# EAGLE design FULLBOARD_Rough_Draft (EAGLE 9.3.0)
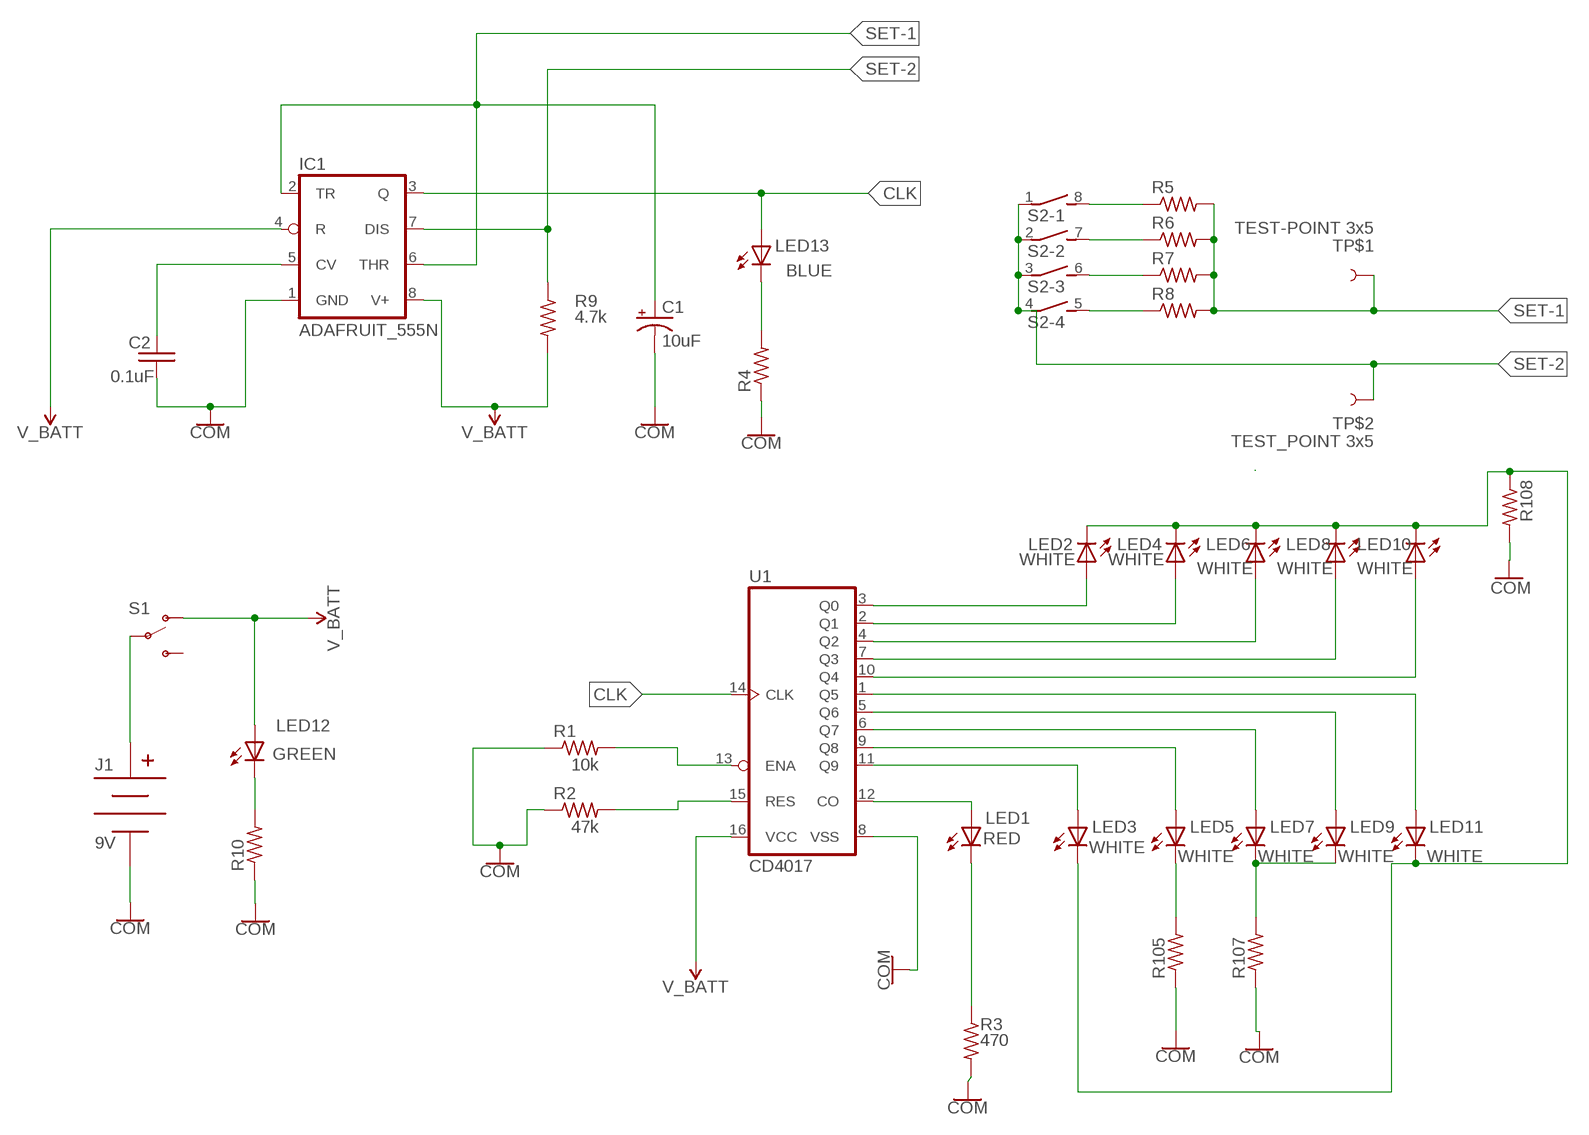
[diagram p0: schematic, sheet 1]

## Parts
C1  10uF  ADAFRUIT_CPOL-USE2-5  [ADAFRUIT_E2-5]
C2  0.1uF  ADAFRUIT_C-US025-025X050  [ADAFRUIT_C025-025X050]
IC1  ADAFRUIT_555N  [ADAFRUIT_DIL08-ROUND]
J1  9V  SPARKFUN-CONNECTORS_BC9VPC  [SPARKFUN-CONNECTORS_BC9VPC]
LED1  RED  ADAFRUIT_LED5MM  [ADAFRUIT_LED5MM]
LED2  WHITE  ADAFRUIT_LED5MM  [ADAFRUIT_LED5MM]
LED3  WHITE  ADAFRUIT_LED5MM  [ADAFRUIT_LED5MM]
LED4  WHITE  ADAFRUIT_LED5MM  [ADAFRUIT_LED5MM]
LED5  WHITE  ADAFRUIT_LED5MM  [ADAFRUIT_LED5MM]
LED6  WHITE  ADAFRUIT_LED5MM  [ADAFRUIT_LED5MM]
LED7  WHITE  ADAFRUIT_LED5MM  [ADAFRUIT_LED5MM]
LED8  WHITE  ADAFRUIT_LED5MM  [ADAFRUIT_LED5MM]
LED9  WHITE  ADAFRUIT_LED5MM  [ADAFRUIT_LED5MM]
LED10  WHITE  ADAFRUIT_LED5MM  [ADAFRUIT_LED5MM]
LED11  WHITE  ADAFRUIT_LED5MM  [ADAFRUIT_LED5MM]
LED12  ADAFRUIT_LED5MM  [ADAFRUIT_LED5MM]
LED13  ADAFRUIT_LED5MM  [ADAFRUIT_LED5MM]
R1  10k  ADAFRUIT_R-US_0207/10  [ADAFRUIT_0207/10]
R2  47k  ADAFRUIT_R-US_0207/10  [ADAFRUIT_0207/10]
R3  470  ADAFRUIT_R-US_0207/10  [ADAFRUIT_0207/10]
R4  ADAFRUIT_R-US_0207/10  [ADAFRUIT_0207/10]
R5  ADAFRUIT_R-US_0207/10  [ADAFRUIT_0207/10]
R6  ADAFRUIT_R-US_0207/10  [ADAFRUIT_0207/10]
R7  ADAFRUIT_R-US_0207/10  [ADAFRUIT_0207/10]
R8  ADAFRUIT_R-US_0207/10  [ADAFRUIT_0207/10]
R9  4.7k  ADAFRUIT_R-US_0207/10  [ADAFRUIT_0207/10]
R10  ADAFRUIT_R-US_0207/10  [ADAFRUIT_0207/10]
R105  ADAFRUIT_R-US_0207/10  [ADAFRUIT_0207/10]
R107  ADAFRUIT_R-US_0207/10  [ADAFRUIT_0207/10]
R108  ADAFRUIT_R-US_0207/10  [ADAFRUIT_0207/10]
S1  SPARKFUN-SWITCHES_SWITCH-SPDT-PTH-11.6X4.0MM  [SPARKFUN-SWITCHES_SWITCH_SPDT_PTH_11.6X4.0MM]
S2  SWITCH-DIL_DIP04S  [SWITCH-DIL_DIP04S]
TP$1  TEST-POINT 3x5  SPARKFUN-CONNECTORS_TEST-POINT3X5  [SPARKFUN-CONNECTORS_PAD.03X.05]
TP$2  TEST_POINT 3x5  SPARKFUN-CONNECTORS_TEST-POINT3X5  [SPARKFUN-CONNECTORS_PAD.03X.05]
U1  CD4017  SPARKFUN-IC-LOGIC_CD4017  [SPARKFUN-IC-LOGIC_DIP16]

## Nets
CLK: IC1.3(Q) LED13.A U1.14(CLK)
COLOR_COMMON: LED1.K(C) R3.1
GND: C1.- C2.2 IC1.1(GND) J1.V- R1.1 R2.1 R3.2 R4.1 R10.1 R105.1 R107.1 R108.2 U1.8(VSS) ; supply symbol labelled COM
N$1: R1.2 U1.13(ENA)
N$2: R2.2 U1.15(RES)
N$3: LED3.A U1.11(Q9)
N$4: LED5.A U1.9(Q8)
N$5: LED12.K(C) R10.2
N$6: LED7.A U1.6(Q7)
N$7: LED1.A U1.12(CO)
N$8: LED9.A U1.5(Q6)
N$9: LED11.A U1.1(Q5)
N$10: LED2.K(C) LED3.K(C) LED4.K(C) LED6.K(C) LED8.K(C) LED10.K(C) LED11.K(C) R108.1
N$11: LED2.A U1.3(Q0)
N$12: LED4.A U1.2(Q1)
N$13: LED6.A U1.4(Q2)
N$14: LED8.A U1.7(Q3)
N$15: LED10.A U1.10(Q4)
N$16: LED13.K(C) R4.2
N$17: LED5.K(C) R105.2
N$19: LED7.K(C) LED9.K(C) R107.2
N$22: J1.V+ S1.2(P)
N$24: R5.1 S2.8
N$25: R6.1 S2.7
N$26: R7.1 S2.6
N$27: R8.1 S2.5
N$29: C2.1 IC1.5(CV)
SET-1: C1.+ IC1.2(TR) IC1.6(THR) R5.2 R6.2 R7.2 R8.2 TP$1.P$1
SET-2: IC1.7(DIS) R9.1 S2.1 S2.2 S2.3 S2.4 TP$2.P$1
V_BATT: IC1.4(R) IC1.8(V+) LED12.A R9.2 S1.1(O) U1.16(VCC)
Unconnected: S1.3(S)

## Library data of the parts
C1 = SECTION B:ADAFRUIT_CPOL-US: POLARIZED CAPACITOR, American symbol
C2 = SECTION B:ADAFRUIT_C-US: CAPACITOR, American symbol
IC1 = SECTION B:ADAFRUIT_*555: TIMER Changed DIP package to have round (not oval) pin pads http://www.ladyada.net/library/pcb/eaglelibrary.html
J1 = SECTION A:SPARKFUN-CONNECTORS_BC9VPC: 9V Battery Holder - PC Mount Standard and Kit footprints included SparkFun Products: SparkFun SparkPunk Sound Kit <https://www.sparkfun.com/products/11177> SparkFun SparkPunk Sequencer Kit <https://www.sparkfun.com/products/12707>; PROD_ID: BATT-10855
LED1-LED11 = SECTION C:ADAFRUIT_LED: LED OSRAM: - CHIPLED LG R971, LG N971, LY N971, LG Q971, LY Q971, LO R971, LY R971 LH N974, LH R974 LS Q976, LO Q976, LY Q976 LO Q996 - Hyper CHIPLED LW Q18S LB Q993, LB Q99A, LB R99A - SideLED LS A670, LO A670, LY A670, LG A670, LP A670 LB A673, LV A673, LT A673, LW A673 LH A674 LY A675 LS A676, LA A676, LO A676, LY A676, LW A676 LS A679, LY A679, LG A679 - Hyper Micro SIDELED® LS Y876, LA Y876, LO Y876, LY Y876 LT Y87S - SmartLED LW L88C, LW L88S LB L89C, LB L89S, LG L890 LS L89K, LO L89K, LY L89K LS L896, LA L896, LO L896, LY L896 - TOPLED LS T670, LO T670, LY T670, LG T670, LP T670 LSG T670, LSP T670, LSY T670, LOP T670, LYG T670 LG T671, LOG T671, LSG T671 LB T673, LV T673, LT T673, LW T673 LH T674 LS T676, LA T676, LO T676, LY T676, LB T676, LH T676, LSB T676, LW T676 LB T67C, LV T67C, LT T67C, LS T67K, LO T67K, LY T67K, LW E67C LS E67B, LA E67B, LO E67B, LY E67B, LB E67C, LV E67C, LT E67C LW T67C LS T679, LY T679, LG T679 LS T770, LO T770, LY T770, LG T770, LP T770 LB T773, LV T773, LT T773, LW T773 LH T774 LS E675, LA E675, LY E675, LS T675 LS T776, LA T776, LO T776, LY T776, LB T776 LHGB T686 LT T68C, LB T68C - Hyper Mini TOPLED® LB M676 - Mini TOPLED Santana® LG M470 LS M47K, LO M47K, LY M47K Source: http://www.osram.convergy.de/
LED12 = SECTION A:ADAFRUIT_LED: LED OSRAM: - CHIPLED LG R971, LG N971, LY N971, LG Q971, LY Q971, LO R971, LY R971 LH N974, LH R974 LS Q976, LO Q976, LY Q976 LO Q996 - Hyper CHIPLED LW Q18S LB Q993, LB Q99A, LB R99A - SideLED LS A670, LO A670, LY A670, LG A670, LP A670 LB A673, LV A673, LT A673, LW A673 LH A674 LY A675 LS A676, LA A676, LO A676, LY A676, LW A676 LS A679, LY A679, LG A679 - Hyper Micro SIDELED® LS Y876, LA Y876, LO Y876, LY Y876 LT Y87S - SmartLED LW L88C, LW L88S LB L89C, LB L89S, LG L890 LS L89K, LO L89K, LY L89K LS L896, LA L896, LO L896, LY L896 - TOPLED LS T670, LO T670, LY T670, LG T670, LP T670 LSG T670, LSP T670, LSY T670, LOP T670, LYG T670 LG T671, LOG T671, LSG T671 LB T673, LV T673, LT T673, LW T673 LH T674 LS T676, LA T676, LO T676, LY T676, LB T676, LH T676, LSB T676, LW T676 LB T67C, LV T67C, LT T67C, LS T67K, LO T67K, LY T67K, LW E67C LS E67B, LA E67B, LO E67B, LY E67B, LB E67C, LV E67C, LT E67C LW T67C LS T679, LY T679, LG T679 LS T770, LO T770, LY T770, LG T770, LP T770 LB T773, LV T773, LT T773, LW T773 LH T774 LS E675, LA E675, LY E675, LS T675 LS T776, LA T776, LO T776, LY T776, LB T776 LHGB T686 LT T68C, LB T68C - Hyper Mini TOPLED® LB M676 - Mini TOPLED Santana® LG M470 LS M47K, LO M47K, LY M47K Source: http://www.osram.convergy.de/; COLOR: GREEN
LED13 = SECTION B:ADAFRUIT_LED: LED OSRAM: - CHIPLED LG R971, LG N971, LY N971, LG Q971, LY Q971, LO R971, LY R971 LH N974, LH R974 LS Q976, LO Q976, LY Q976 LO Q996 - Hyper CHIPLED LW Q18S LB Q993, LB Q99A, LB R99A - SideLED LS A670, LO A670, LY A670, LG A670, LP A670 LB A673, LV A673, LT A673, LW A673 LH A674 LY A675 LS A676, LA A676, LO A676, LY A676, LW A676 LS A679, LY A679, LG A679 - Hyper Micro SIDELED® LS Y876, LA Y876, LO Y876, LY Y876 LT Y87S - SmartLED LW L88C, LW L88S LB L89C, LB L89S, LG L890 LS L89K, LO L89K, LY L89K LS L896, LA L896, LO L896, LY L896 - TOPLED LS T670, LO T670, LY T670, LG T670, LP T670 LSG T670, LSP T670, LSY T670, LOP T670, LYG T670 LG T671, LOG T671, LSG T671 LB T673, LV T673, LT T673, LW T673 LH T674 LS T676, LA T676, LO T676, LY T676, LB T676, LH T676, LSB T676, LW T676 LB T67C, LV T67C, LT T67C, LS T67K, LO T67K, LY T67K, LW E67C LS E67B, LA E67B, LO E67B, LY E67B, LB E67C, LV E67C, LT E67C LW T67C LS T679, LY T679, LG T679 LS T770, LO T770, LY T770, LG T770, LP T770 LB T773, LV T773, LT T773, LW T773 LH T774 LS E675, LA E675, LY E675, LS T675 LS T776, LA T776, LO T776, LY T776, LB T776 LHGB T686 LT T68C, LB T68C - Hyper Mini TOPLED® LB M676 - Mini TOPLED Santana® LG M470 LS M47K, LO M47K, LY M47K Source: http://www.osram.convergy.de/; COLOR: BLUE
R1-R4 R10 R105 R107 R108 = SECTION C:ADAFRUIT_R-US_: RESISTOR, American symbol
R5-R8 = SECTION A:ADAFRUIT_R-US_: RESISTOR, American symbol
R9 = SECTION B:ADAFRUIT_R-US_: RESISTOR, American symbol
S1 = SECTION A:SPARKFUN-SWITCHES_SWITCH-SPDT: Single Pole, Double Throw (SPDT) Switch Single-pole, double-throw (SPDT) switch. Variant Overview SMD-AYZ0202 Surface Mount DPDT Switch <https://www.sparkfun.com/products/597> (COM-00597) Used on e.g. LilyPad Arduino USB - ATmega32U4 Board <https://www.sparkfun.com/products/12049> PTH-11.6X4.0MM SPDT Mini Power Switch <https://www.sparkfun.com/products/102> (COM-00102) Used on e.g. SparkFun Simon Says - Through-Hole Soldering Kit <https://www.sparkfun.com/products/10547> (KIT-10547) PTH-11.6X4.0MM-KIT KIT version of SPDT Mini Power Switch - Simplifies soldering by removing tStop of switch pins - only one side can be soldered. PTH-11.6X4.0MM-LOCK LOCK version of SPDT Mini Power Switch - Offset pins hold switch in place for easier soldering. SMD-RIGHT-ANGLE Surface Mount Right Angle Switch <https://www.sparkfun.com/products/10860> (COM-10860) Used on e.g. SparkFun ESP8266 Thing <https://www.sparkfun.com/products/13231>; PROD_ID: SWCH-10651; SF_ID: COM-00597; SF_SKU: COM-10860
S2 = SECTION A:SWITCH-DIL_DIP04S: DIL/CODE SWITCH; OC_FARNELL: unknown; OC_NEWARK: unknown
TP$1 TP$2 = SECTION A:SPARKFUN-CONNECTORS_TEST-POINT: SparkFun Test Points Bare copper test points for troubleshooting or In-Circuit-Testing. These are used by our Production team for verifying production board runs using pogo-pins on test beds. SparkFun Products: SparkFun LSM9DS1 Breakout <https://www.sparkfun.com/products/13284> SparkFun PSOC <https://www.sparkfun.com/products/13714> SparkFun Load Cell Amplifier <https://www.sparkfun.com/products/13879>
U1 = SECTION C:SPARKFUN-IC-LOGIC_CD4017: 10-Out Decade Counter Datasheet <https://cdn.sparkfun.com/datasheets/Kits/cd4022b.pdf> SparkFun Products SparkFun SparkPunk Sequencer Kit <https://www.sparkfun.com/products/12707> (KIT-12707); PROD_ID: IC-11929

## Board
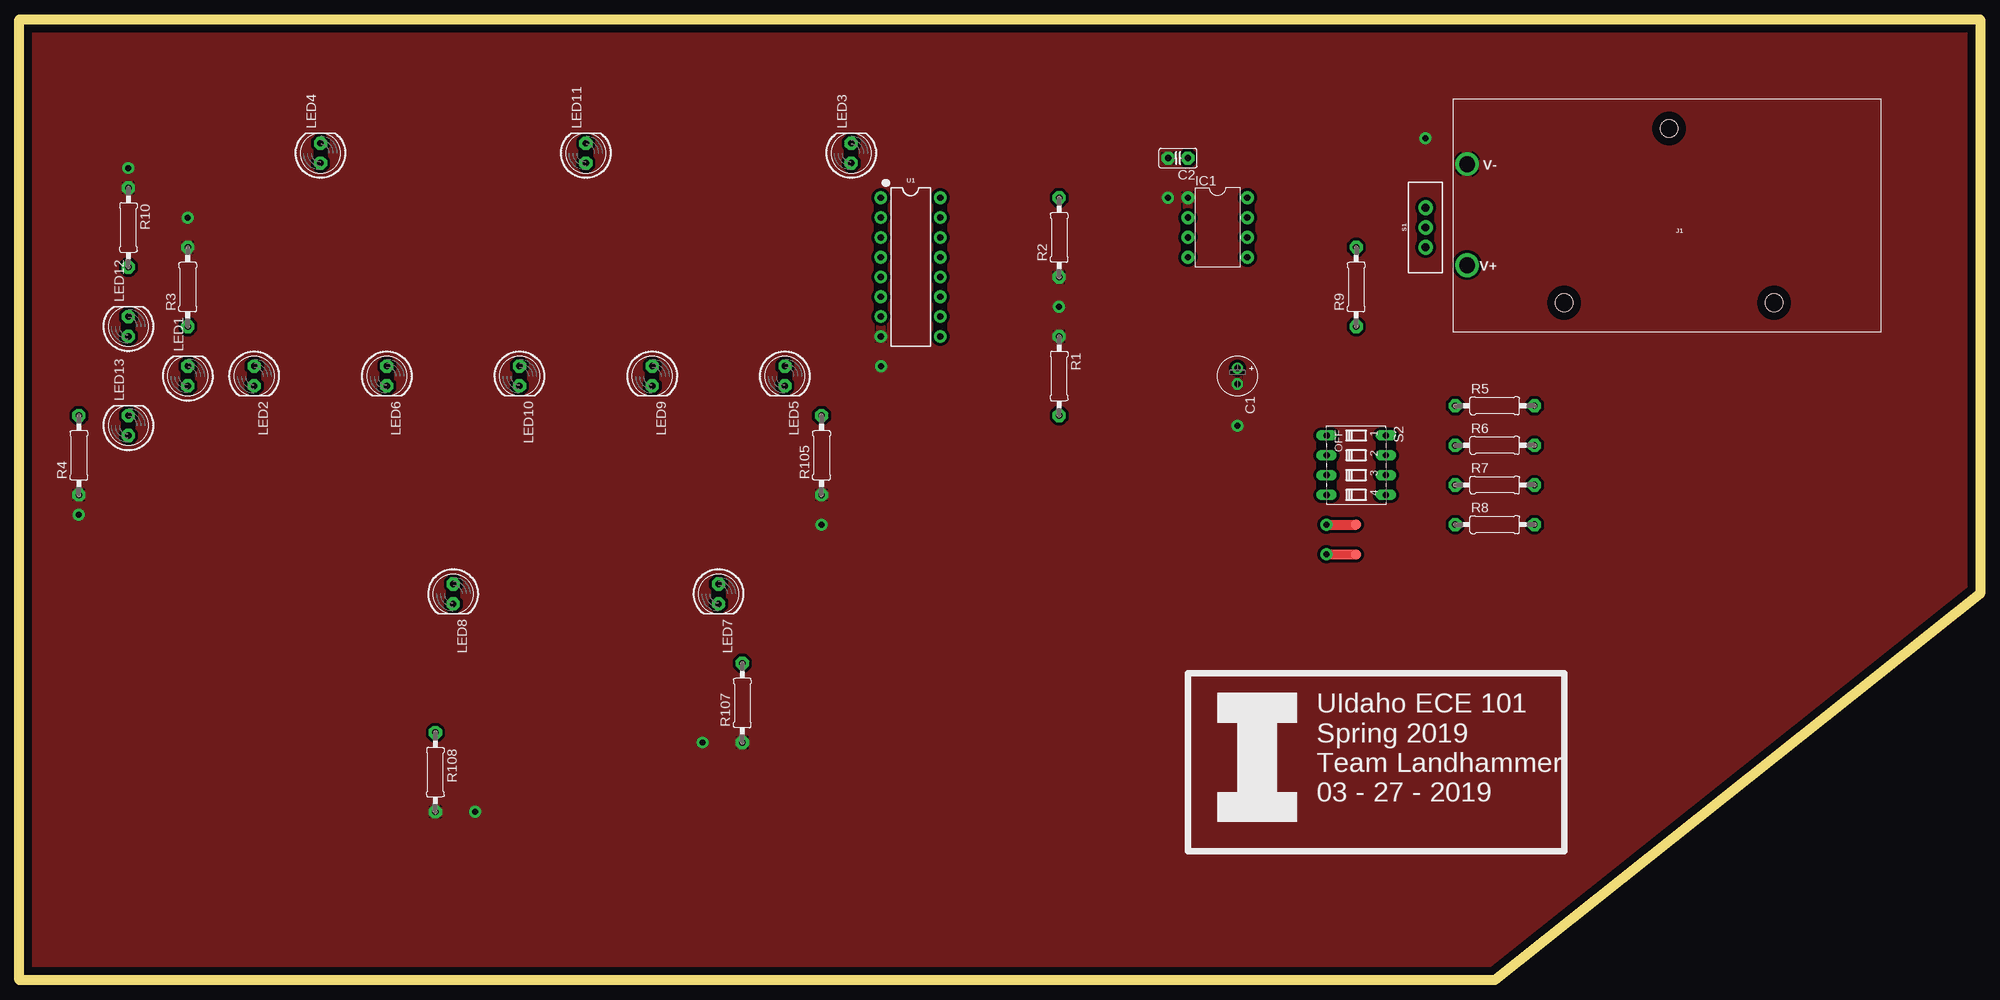
[diagram p1: board, top side]
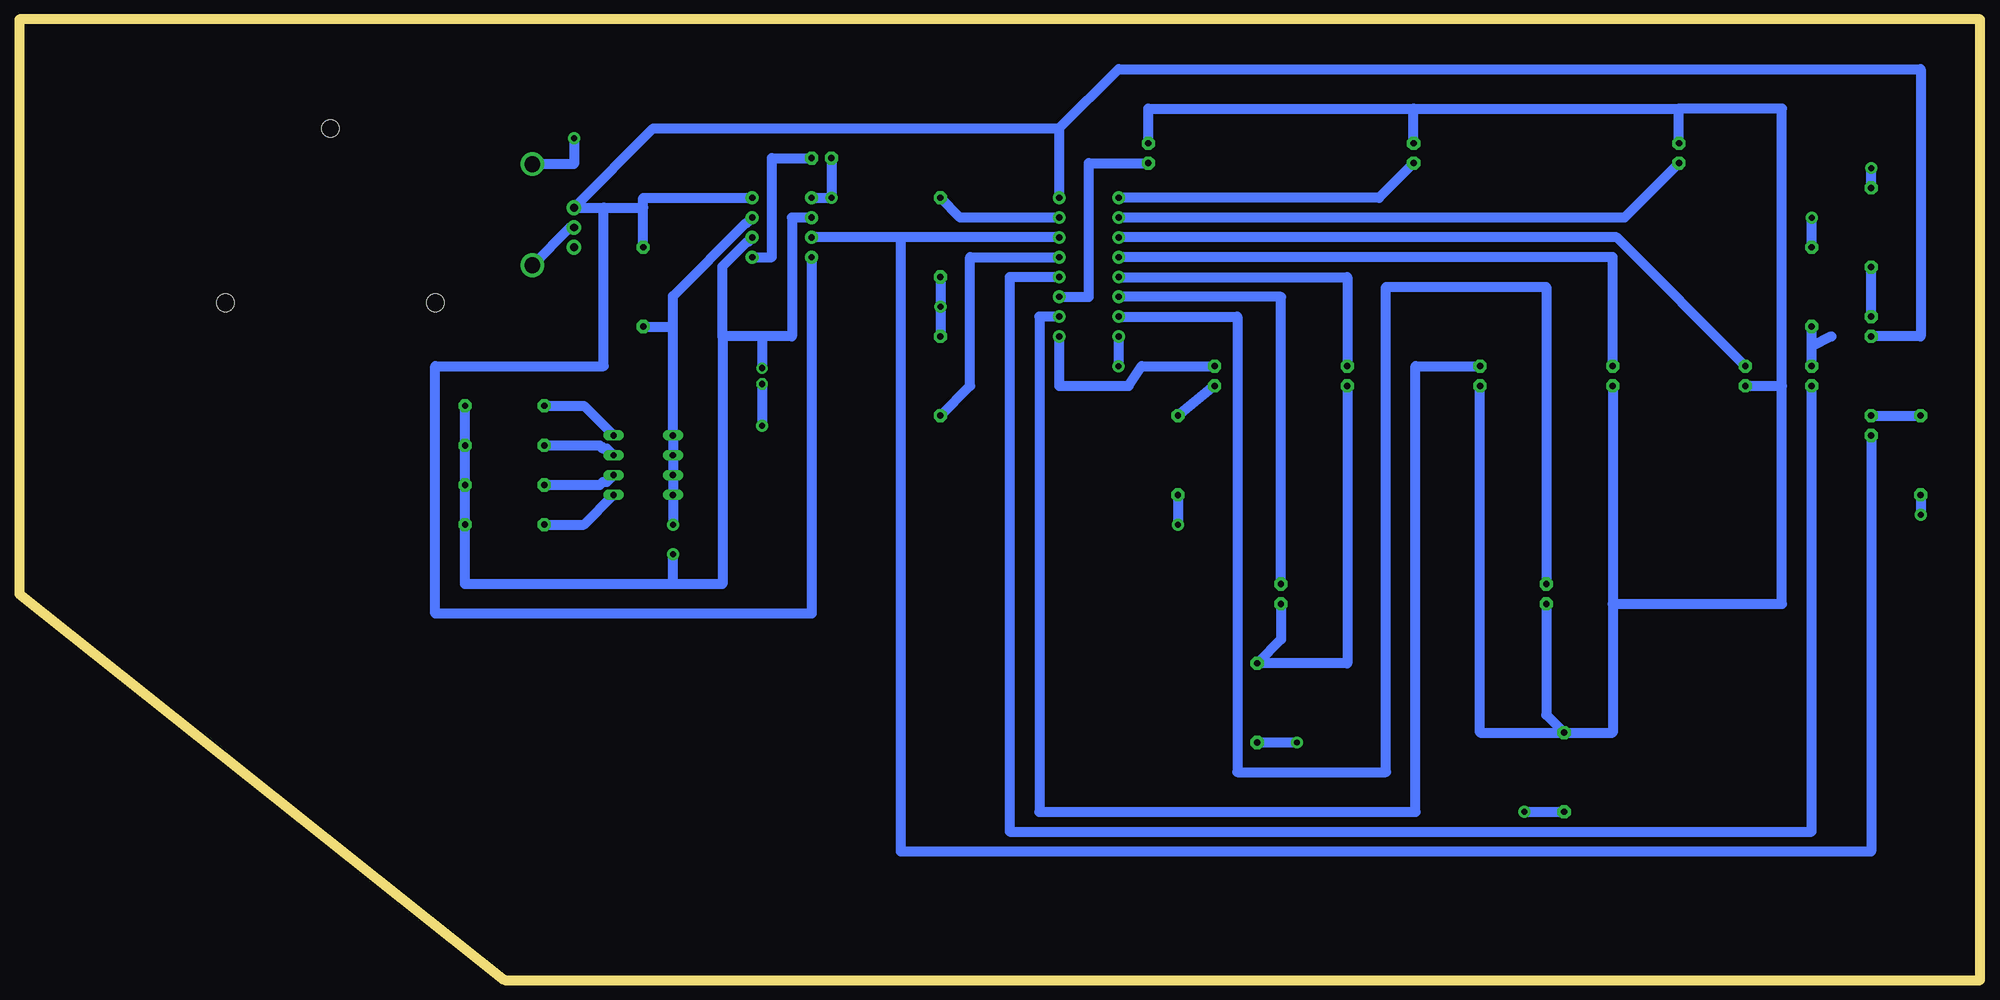
[diagram p2: board, bottom side, seen from below]

Size 251.46 x 123.19 mm. Coordinates in mm from the lower left corner, seen from the top.
Outline: 0,123.19 251.46,123.19 251.46,49.53 189.23,0 0,0 0,123.19
Copper layers (1*16): Top 0.035mm / dielectric 1.5mm / Bottom 0.035mm
Design rules "default *": minimum track width 6mil, minimum drill 0.35mm, track to track 15mil, track to pad 15mil, pad to pad 15mil, via to via 15mil, smd to smd 6mil, copper to edge 40mil, drill to drill 6mil, minimum pad ring 10mil, minimum via ring 8mil, stop-mask expansion 4mil, vias tented up to drill 0mil, thermal gap 10mil

### Footprints (pad centres in the part's own frame; a part is rotated, then mirrored left to right if it is on the bottom)
ADAFRUIT_E2-5 = drill 0.813 pad 1.422: + -1.016,0 | drill 0.813 pad 1.422 octagon: - 1.016,0
ADAFRUIT_C025-025X050 = drill 0.813 pad 1.676 octagon: 1 -1.27,0; 2 1.27,0
ADAFRUIT_DIL08-ROUND = drill 0.813 pad 1.676: 1 -3.81,-3.81; 2 -1.27,-3.81; 3 1.27,-3.81; 4 3.81,-3.81; 5 3.81,3.81; 6 1.27,3.81; 7 -1.27,3.81; 8 -3.81,3.81
SPARKFUN-CONNECTORS_BC9VPC = drill 2.032: V+ 53.086,21.336; V- 53.086,8.382 | hole 2.286: 27.178,3.81; 13.716,26.162; 40.64,26.162
ADAFRUIT_LED5MM = drill 0.813 pad 1.676 octagon: A -1.27,0; K 1.27,0
ADAFRUIT_0207/10 = drill 0.813 pad 1.676 octagon: 1 -5.08,0; 2 5.08,0
SPARKFUN-SWITCHES_SWITCH_SPDT_PTH_11.6X4.0MM = drill 1.016 pad 1.88: 1 0,2.54; 2 0,0; 3 0,-2.54
SWITCH-DIL_DIP04S = drill 0.813 long: 1 -3.81,-3.81; 2 -1.27,-3.81; 3 1.27,-3.81; 4 3.81,-3.81; 5 3.81,3.81; 6 1.27,3.81; 7 -1.27,3.81; 8 -3.81,3.81
SPARKFUN-CONNECTORS_PAD.03X.05 = smd 1.27 x 1.27: P$1 0,0
SPARKFUN-IC-LOGIC_DIP16 = drill 0.813 pad 1.626: 1 -8.89,-3.81; 2 -6.35,-3.81; 3 -3.81,-3.81; 4 -1.27,-3.81; 5 1.27,-3.81; 6 3.81,-3.81; 7 6.35,-3.81; 8 8.89,-3.81; 9 8.89,3.81; 10 6.35,3.81; 11 3.81,3.81; 12 1.27,3.81; 13 -1.27,3.81; 14 -3.81,3.81; 15 -6.35,3.81; 16 -8.89,3.81

### Placement (x,y rotation side)
C1  156.21,77.47 270 top
C2  148.59,105.41 180 top
IC1  153.67,96.52 270 top
J1  238.76,113.03 180 top
LED1  21.59,77.47 90 top
LED2  30.1,77.47 270 top
LED3  106.68,106.05 90 top
LED4  38.61,106.05 90 top
LED5  98.17,77.47 270 top
LED6  47.12,77.47 270 top
LED7  89.66,49.53 270 top
LED8  55.63,49.53 270 top
LED9  81.15,77.47 270 top
LED10  64.14,77.47 270 top
LED11  72.64,106.05 90 top
LED12  13.97,83.82 90 top
LED13  13.97,71.12 90 top
R1  133.35,77.47 270 top
R2  133.35,95.25 90 top
R3  21.59,88.9 90 top
R4  7.62,67.31 90 top
R5  189.23,73.66 0 top
R6  189.23,68.58 0 top
R7  189.23,63.5 0 top
R8  189.23,58.42 0 top
R9  171.45,88.9 90 top
R10  13.97,96.52 270 top
R105  102.87,67.31 90 top
R107  92.71,35.56 90 top
R108  53.34,26.67 270 top
S1  180.34,96.52 0 top
S2  171.45,66.04 270 top
TP$1  171.45,54.61 0 top
TP$2  171.45,58.42 0 top
U1  114.3,91.44 270 top

### Tracks (layer width: path | path; a pad name or v marks a point on that pad's centre or on a via)
CLK
  Bottom 1.27: U1.14 138.43,95.25 | 138.43,95.25 IC1.3 | 138.43,95.25 138.43,16.51 13.97,16.51 LED13.A
COLOR_COMMON
  Bottom 1.27: LED1.K 21.59,81.28 | 21.59,81.28 R3.1 | 19.05,82.55 21.59,81.28
GND  (via drill 0.76 pad 1.52)
  Bottom 1.27: R105.1 v102.87,58.42 | R107.1 v87.63,30.48 | v58.42,21.59 R108.2 | U1.8 v110.49,78.74 | R2.1 v133.35,86.36 R1.1 | C2.2 v147.32,100.33 IC1.1 | C1.- v156.21,71.12 | v180.34,107.95 180.34,104.65 J1.V- | R3.2 v21.59,97.79 | R10.1 v13.97,104.14 | R4.1 v7.62,59.69
  pour Top: 0,123.19 0,0 189.23,0 251.46,49.53 251.46,123.19
N$1
  Bottom 1.27: R1.2 129.54,76.2 129.54,92.71 U1.13
N$2
  Bottom 1.27: U1.15 130.81,97.79 R2.2
N$3
  Bottom 1.27: U1.11 114.3,87.63 114.3,104.78 LED3.A
N$4
  Bottom 1.27: U1.9 118.11,76.2 109.22,76.2 107.53,78.74 LED5.A
N$5
  Bottom 1.27: LED12.K R10.2
N$6
  Bottom 1.27: LED7.A 89.66,87.63 U1.6
N$7
  Bottom 1.27: U1.12 124.46,90.17 124.46,19.05 21.59,19.05 LED1.A
N$8
  Bottom 1.27: U1.5 81.15,90.17 LED9.A
N$9
  Bottom 1.27: LED11.A 77.09,100.33 U1.1
N$10
  Bottom 1.27: LED3.K 106.68,111.76 72.64,111.76 | 72.64,111.76 38.61,111.76 | LED4.K 38.61,111.76 | LED11.K 72.64,111.76 | 38.61,111.76 25.4,111.76 25.4,76.2 | R108.1 47.12,31.75 47.12,48.26 | 47.12,48.26 25.4,48.26 25.4,76.2 | LED2.K 25.4,76.2 | LED6.K 47.12,48.26 | LED8.K 55.63,34.04 R108.1 | R108.1 64.14,31.75 LED10.K
N$11
  Bottom 1.27: LED2.A 46.61,95.25 U1.3
N$12
  Bottom 1.27: LED4.A 45.59,97.79 U1.2
N$13
  Bottom 1.27: U1.4 47.12,92.71 LED6.A
N$14
  Bottom 1.27: U1.7 95.25,85.09 95.25,26.67 76.2,26.67 76.2,88.9 55.63,88.9 LED8.A
N$15
  Bottom 1.27: U1.10 120.65,85.09 120.65,21.59 72.39,21.59 72.39,78.74 LED10.A
N$16
  Bottom 1.27: LED13.K R4.2
N$17
  Bottom 1.27: LED5.K R105.2
N$19
  Bottom 1.27: LED9.K 81.15,40.64 R107.2 89.66,43.69 LED7.K
N$22
  Bottom 1.27: J1.V+ 180.85,96.52 S1.2
N$24
  Bottom 1.27: R5.1 179.07,73.66 S2.8
N$25
  Bottom 1.27: R6.1 177.02,68.58 176.62,68.17 176.12,68.17 S2.7
N$26
  Bottom 1.27: R7.1 177.02,63.5 176.62,63.91 176.12,63.91 S2.6
N$27
  Bottom 1.27: R8.1 179.07,58.42 S2.5
N$29
  Bottom 1.27: IC1.5 154.94,92.71 154.94,105.41 C2.1
SET-1  (via drill 0.76 pad 1.52)
  Top 1.27: v167.64,54.61 TP$1.P$1
  Bottom 1.27: IC1.2 152.4,97.79 152.4,82.55 156.21,82.55 | 156.21,82.55 161.29,82.55 | IC1.6 158.17,94.56 158.25,94.56 161.29,91.52 161.29,82.55 | 161.29,82.55 161.29,50.8 167.64,50.8 | 167.64,50.8 194.31,50.8 R8.2 R7.2 R6.2 R5.2 | 156.21,82.55 C1.+ | 167.64,50.8 v167.64,54.61
SET-2  (via drill 0.76 pad 1.52)
  Top 1.27: v167.64,58.42 TP$2.P$1
  Bottom 1.27: IC1.7 158.17,97.1 158.25,97.1 167.64,87.71 167.64,83.82 | 167.64,83.82 S2.1 S2.2 S2.3 S2.4 v167.64,58.42 | R9.1 167.64,83.82
V_BATT
  Bottom 1.27: 176.53,99.06 S1.1 170.18,109.22 118.11,109.22 | 176.53,99.06 171.45,99.06 | IC1.8 171.45,100.33 171.45,99.06 | 118.11,109.22 U1.16 | 118.11,109.22 110.49,116.84 7.62,116.84 7.62,82.55 LED12.A | R9.2 171.45,99.06 | IC1.4 149.86,46.99 198.12,46.99 198.12,78.74 176.53,78.74 176.53,99.06

### Text on the board
tNames: UIdaho ECE 101 / Spring 2019 / Team Landhammer / 03 - 27 - 2019